# Altium schematic sheet Arduino Mini.SchDoc
size A4; SheetNumber: 1; SheetTotal: 1
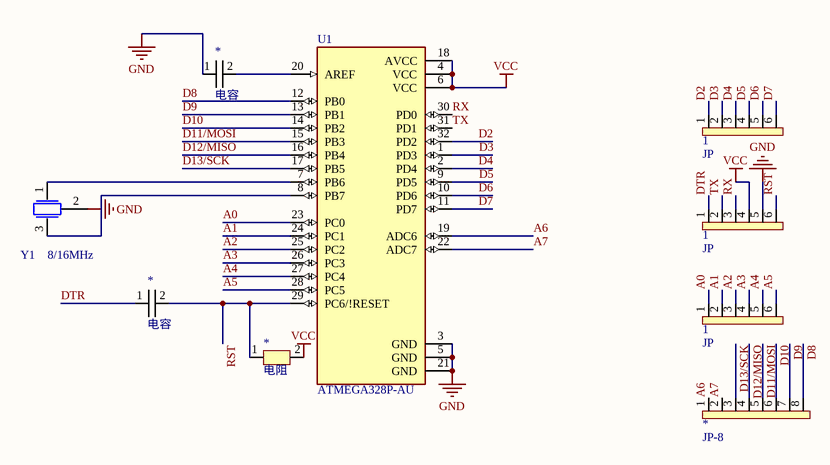
[diagram p0: Arduino Mini.SchDoc]

## Parts
(Parts that share a designator on the sheet are numbered #1, #2 ... from top to bottom, then left to right.)
1#1  JP  [JP]
1#2  JP  [JP]
1#3  JP  [JP]
*#1  电容  [0805]
*#2  电容  [0805]
*#3  电阻  [0805]
*#4  JP-8  [JP-8]
U1  ATMEGA328P-AU  [Atmega]
Y1  8/16MHz  [CSTCE]

## Nets
GND: 1#2.5(D6) *#1.1(+) U1.3(GND) U1.5(GND) U1.21(GND) Y1.2
VCC: 1#2.4(D5) *#3.2 U1.4(VCC) U1.6(VCC) U1.18(AVCC)
A0: 1#3.1(D2) U1.23(PC0)
A1: 1#3.2(D3) U1.24(PC1)
A2: 1#3.3(D4) U1.25(PC2)
A3: 1#3.4(D5) U1.26(PC3)
A4: 1#3.5(D6) U1.27(PC4)
A5: 1#3.6(D7) U1.28(PC5)
A6: *#4.1(D2) U1.19(ADC6)
A7: *#4.2(D3) U1.22(ADC7)
D2: 1#1.1(D2) U1.32(PD2)
D3: 1#1.2(D3) U1.1(PD3)
D4: 1#1.3(D4) U1.2(PD4)
D5: 1#1.4(D5) U1.9(PD5)
D6: 1#1.5(D6) U1.10(PD6)
D7: 1#1.6(D7) U1.11(PD7)
D8: *#4.8(D7) U1.12(PB0)
D9: *#4.7(D7) U1.13(PB1)
D10: *#4.6(D7) U1.14(PB2)
D11/MOSI: *#4.5(D6) U1.15(PB3)
D12/MISO: *#4.4(D5) U1.16(PB4)
D13/SCK: *#4.3(D4) U1.17(PB5)
DTR: 1#2.1(D2) *#2.1(+)
RST: 1#2.6(D7) *#2.2(-) *#3.1 U1.29(PC6/!RESET)
RX: 1#2.3(D4) U1.30(PD0)
TX: 1#2.2(D3) U1.31(PD1)
Net*#1_2: *#1.2(-) U1.20(AREF)
NetU1_7: U1.7(PB6) Y1.1
NetU1_8: U1.8(PB7) Y1.3

## Library data of the parts
U1 = ATMEGA328P-AU: AVR AVRÂ® ATmega Microcontroller IC 8-Bit 20MHz 32KB _16K x 16_ FLASH 32-TQFP _7x7_; MF: Microchip; Value: *; SnapEDA_Link: https://www.snapeda.com/parts/ATMEGA328P-AU/Microchip/view-part/44280/?ref=snap; MP: ATMEGA328P-AU; Availability: Unavailable; Price: None; Package: TQFP-32 Microchip
Y1 = 晶振-3Pin: 村田贴片